# EAGLE schematic fan-control (EAGLE 9.2.2)
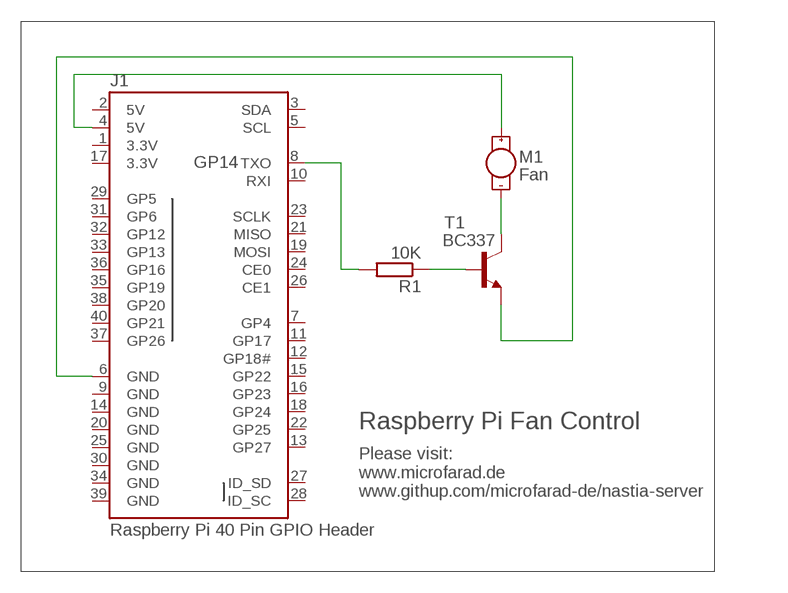
[diagram p0: schematic, sheet 1]

## Parts
J1  Raspberry Pi 40 Pin GPIO Header  RASPBERRYPI-40-PIN-GPIO_PTH_NO_SHROUD  [2X20]
M1  Fan  MOTOR10MM  [VIBE-MOTOR-10MM]
R1  10K  R-EU_0207/7  [0207/7]
T1  BC337  [TO92]

## Nets
GP14: J1.8(TXO) R1.2
N$1: R1.1 T1.2(B)
N$2: M1.- T1.3(C)
N$3: J1.4(5V) M1.+
N$4: J1.6(GND) T1.1(E)
Unconnected: J1.3(SDA) J1.5(SCL) J1.7(GP4) J1.10(RXI) J1.11(GP17) J1.12(GP18#) J1.13(GP27) J1.15(GP22) J1.16(GP23) J1.18(GP24) J1.19(MOSI) J1.21(MISO) J1.22(GP25) J1.23(SCLK) J1.24(CE0) J1.26(CE1) J1.27(ID_SD) J1.28(ID_SC) J1.29(GP5) J1.31(GP6) J1.32(GP12) J1.33(GP13) J1.35(GP19) J1.36(GP16) J1.37(GP26) J1.38(GP20) J1.40(GP21)

## Notes on the sheet
- Raspberry Pi Fan Control
- Please visit:
  www.microfarad.de
  www.githup.com/microfarad-de/nastia-server

## Power pins joined to a net without a drawn wire
3.3V: J1.1(3.3V) J1.17(3.3V)
5V: J1.2(5V)
GND: J1.9(GND) J1.14(GND) J1.20(GND) J1.25(GND) J1.30(GND) J1.34(GND) J1.39(GND)

## Library data of the parts
J1 = SparkFun-Connectors:RASPBERRYPI-40-PIN-GPIO: Raspberry Pi GPIO Header 2x20 pin connector, as found on B, B+, A+ models. Both shrouded PTH and SMT versions available. SparkFun Products: GPIO Shrouded Header <https://www.sparkfun.com/products/13054>- PTH SparkFun Pi Wedge (Preassembled) <https://www.sparkfun.com/products/13717>
M1 = SparkFun-Electromechanical:MOTOR: Motor (Single-Phase) Two-terminal, single-phase motors. SparkFun Products Vibration Motor <https://www.sparkfun.com/products/8449> (ROB-08449) Physical dimension and wire connections for this powerful vibration motor. Motor has a self adhesive backing.; PROD_ID: COMP-08572; SF_SKU: ROB-08449
R1 = rcl:R-EU_: RESISTOR, European symbol; SPICEPREFIX: R
T1 = transistor:BC337: NPN TRANSISTOR